# EasyEDA schematic Energy_Meter_Final__.json
TITLE: Sheet_1; REV: 1.0; Date: 2023-03-16; Sheet: 1/1; Company: Your Company
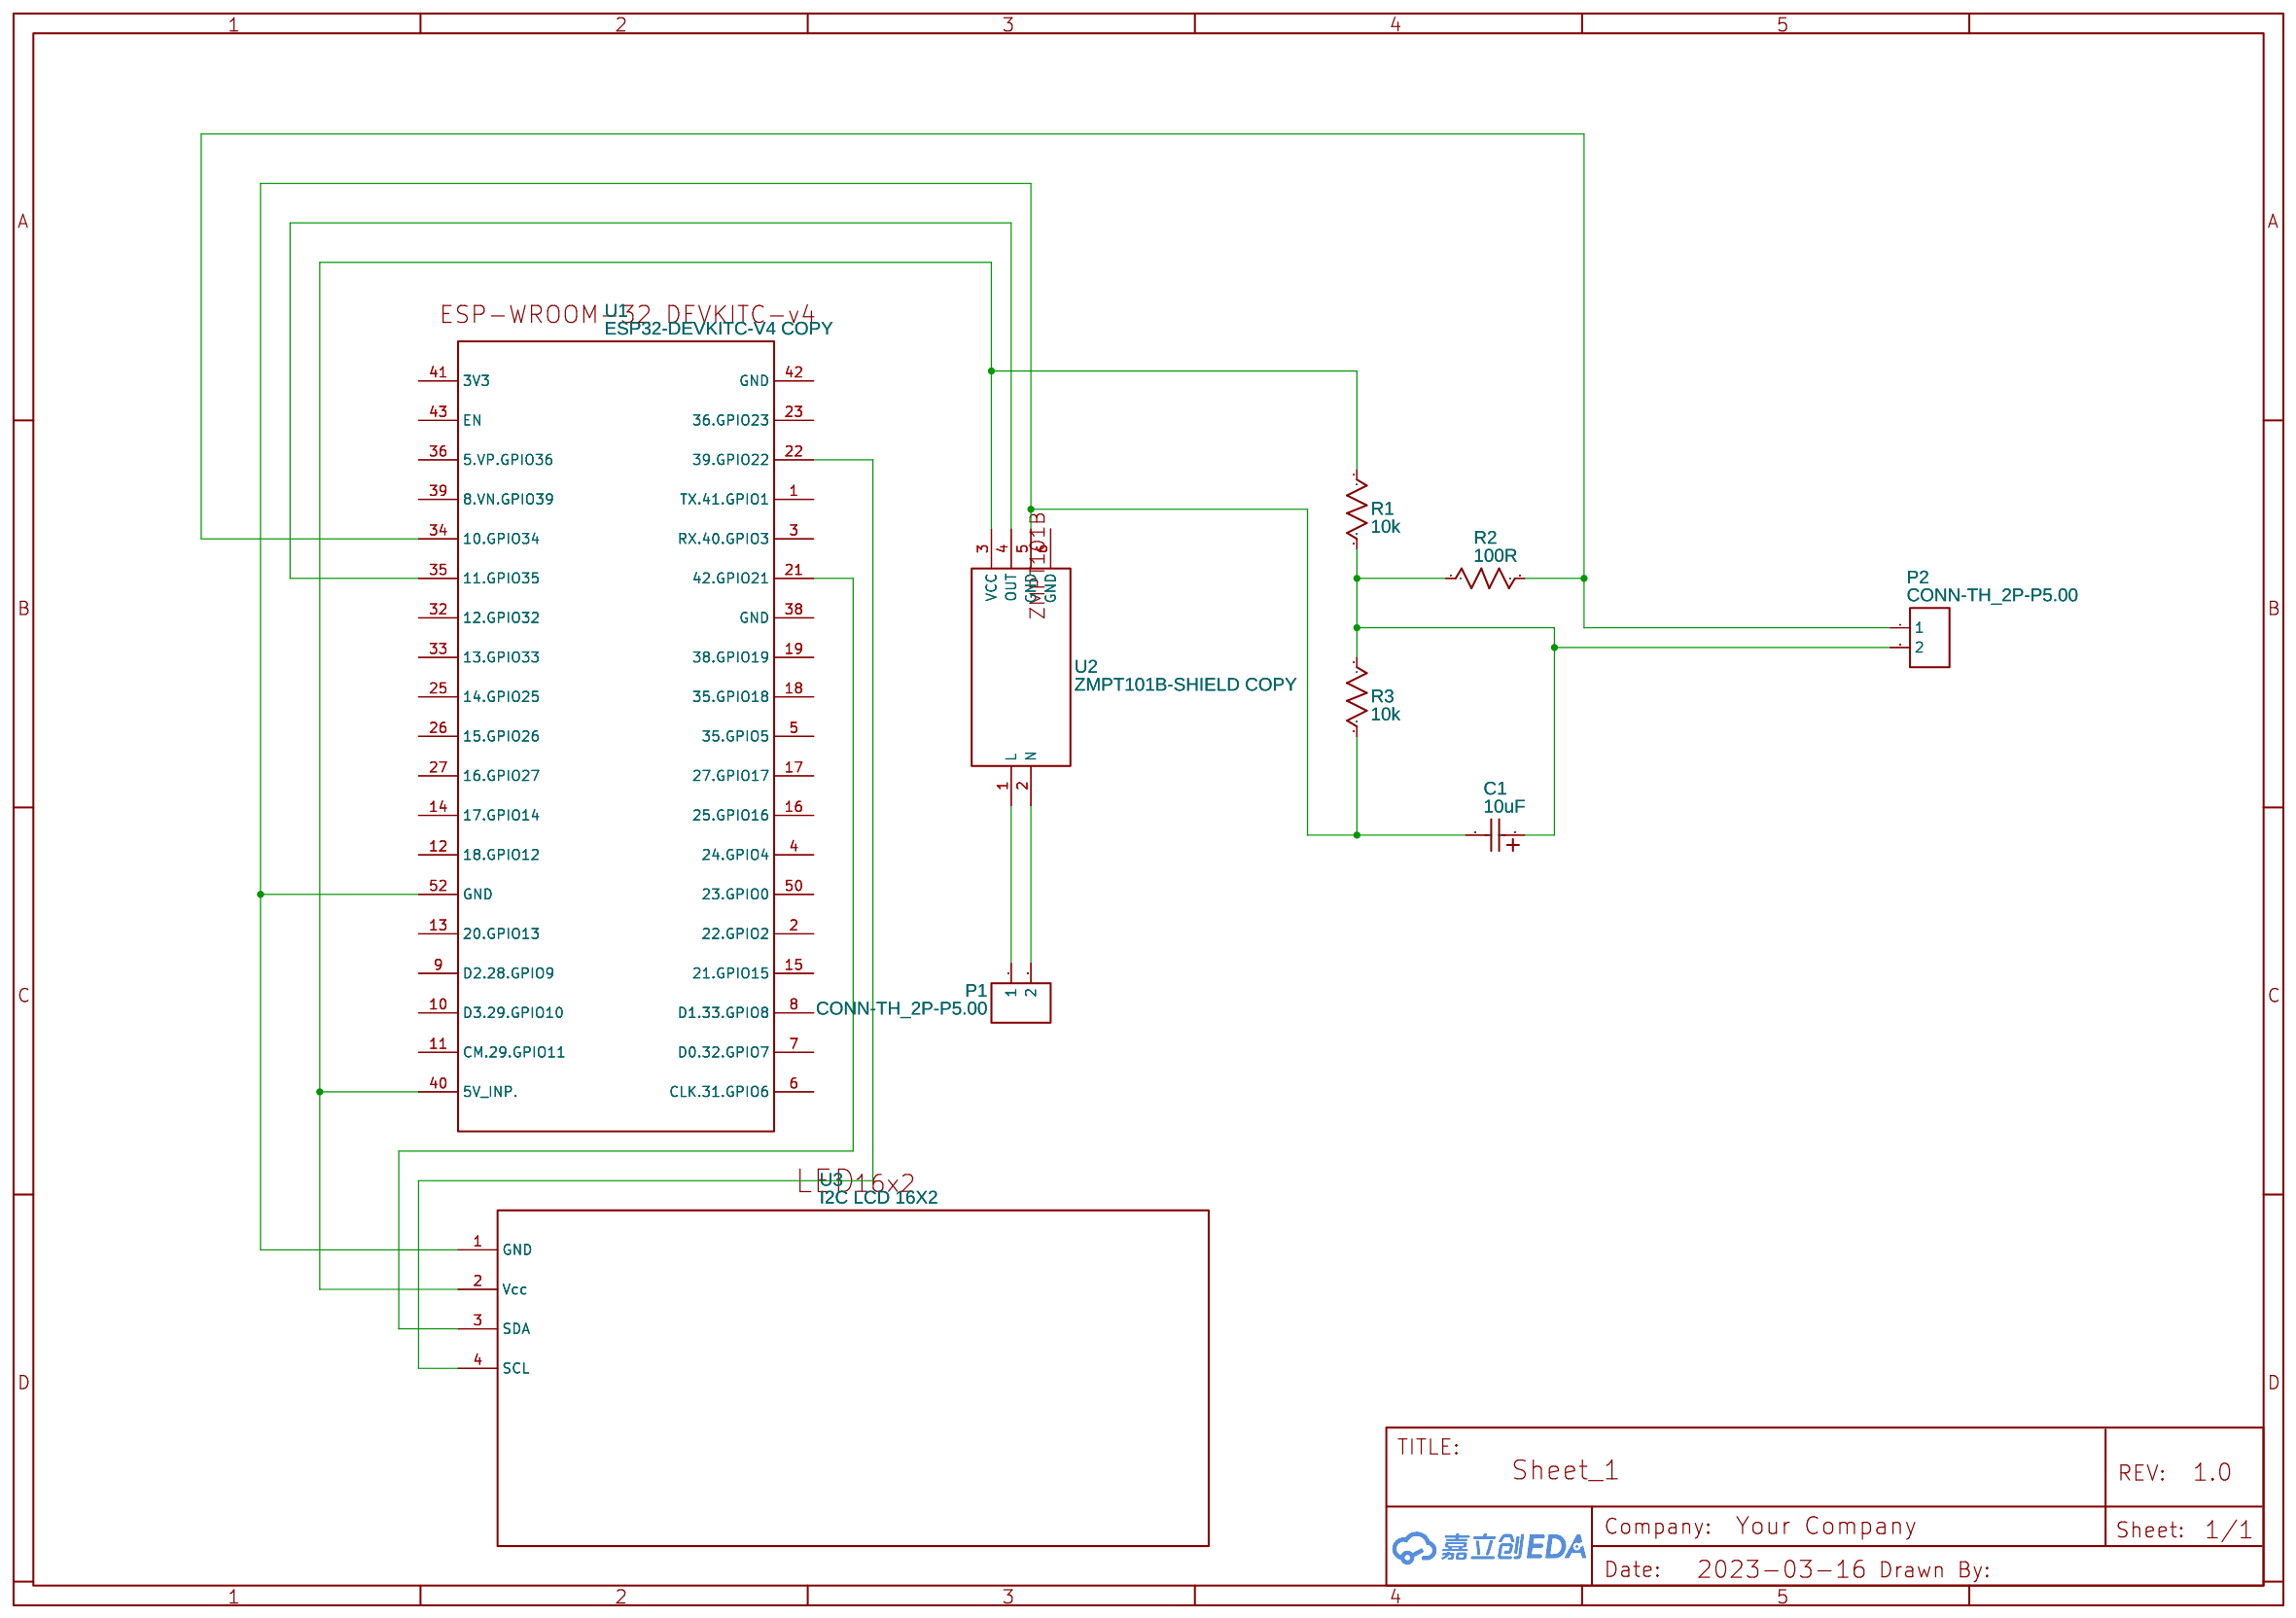
[diagram p0: schematic sheet]

## Parts
C1  10uF  [PKG-CAP-D5.0XF2.0-VERT]
P1  CONN-TH_2P-P5.00  [CONN-TH_2P-P5.00]
P2  CONN-TH_2P-P5.00  [CONN-TH_2P-P5.00]
R1  10k  [R_AXIAL-0.5]
R2  100R  [R_AXIAL-0.5]
R3  10k  [R_AXIAL-0.5]
U1  ESP32-DEVKITC-V4 COPY  [ESP32-DEVKITC-V4]
U2  ZMPT101B-SHIELD COPY  [ZMPT101B-MODULE]
U3  I2C LCD 16X2  [I2C LCD-16X2]

## Library data of the parts
C1 = 10uF: Voltage: 25V; Tolerance: ±20%; Supplier Part: 2068976; Supplier: Element14; Manufacturer: KEMET; Manufacturer Part: ESK106M025AC3AA; link: http://www.farnell.com/datasheets/2316969.pdf?_ga=2.55896749.784710130.1506872032-238689616.1505921947&_gac=1.137094660.1506872032.EAIaIQobChMItau139_P1gIVBZ8bCh15DgKNEAAYASAAEgK60PD_BwE; Contributor: Prof. Ing. F. Scordino
P1 P2 = CONN-TH_2P-P5.00: Supplier: LCSC; Contributor: LCEDA_Lib
R1-R3 = R_AXIAL-0.5_US: Contributor: LCEDA_Lib
U1 = ESP32-DEVKITC-V4 COPY: Manufacturer: Espressif Systems; Manufacturer Part: ESP32-DevKitC; Supplier: Mouser; Supplier Part: 356-ESP32-DEVKITC; link: http://esp-idf.readthedocs.io/en/latest/get-started/get-started-devkitc.html; Contributor: Mesmero
U2 = ZMPT101B-SHIELD COPY: Manufacturer: sterling; Supplier: LCSC; link: https://lcsc.com/product-detail/Current-Transformers_Qingxian-Zeming-Langxi-Elec-ZMPT101B_C111858.html; Contributor: Bosco_Sterling
U3 = I2C LCD 16X2: Contributor: Valery+De+Smedt; sourceId: VlDxP71jB

## Nets
Net-(C1-1): C1.1 P2.2 R1.2 R2.1 R3.1
Net-(C1-2): C1.2 R3.2 U1.52(GND) U2.5(GND) U3.1(GND)
Net-(P1-1): P1.1 U2.1(L)
Net-(P1-2): P1.2 U2.2(N)
Net-(P2-1): P2.1 R2.2 U1.34(10.GPIO34)
Net-(R1-1): R1.1 U1.40(5V INP.) U2.3(VCC) U3.2(Vcc)
Net-(U1-21): U1.21(42.GPIO21) U3.3(SDA)
Net-(U1-22): U1.22(39.GPIO22) U3.4(SCL)
Net-(U1-35): U1.35(11.GPIO35) U2.4(OUT)

Not connected (* = marked no-connect by the designer): U1 1(TX.41.GPIO1) 2(22.GPIO2) 3(RX.40.GPIO3) 4(24.GPIO4) 5(35.GPIO5) 6(CLK.31.GPIO6) 7(D0.32.GPIO7) 8(D1.33.GPIO8) 9(D2.28.GPIO9) 10(D3.29.GPIO10) 11(CM.29.GPIO11) 12(18.GPIO12) 13(20.GPIO13) 14(17.GPIO14) 15(21.GPIO15) 16(25.GPIO16) 17(27.GPIO17) 18(35.GPIO18) 19(38.GPIO19) 23(36.GPIO23) 25(14.GPIO25) 26(15.GPIO26) 27(16.GPIO27) 32(12.GPIO32) 33(13.GPIO33) 36(5.VP.GPIO36) 38(GND) 39(8.VN.GPIO39) 41(3V3) 42(GND) 43(EN) 50(23.GPIO0); U2 6(GND)
